# EAGLE design iv_diff_v2 (EAGLE 5.12)
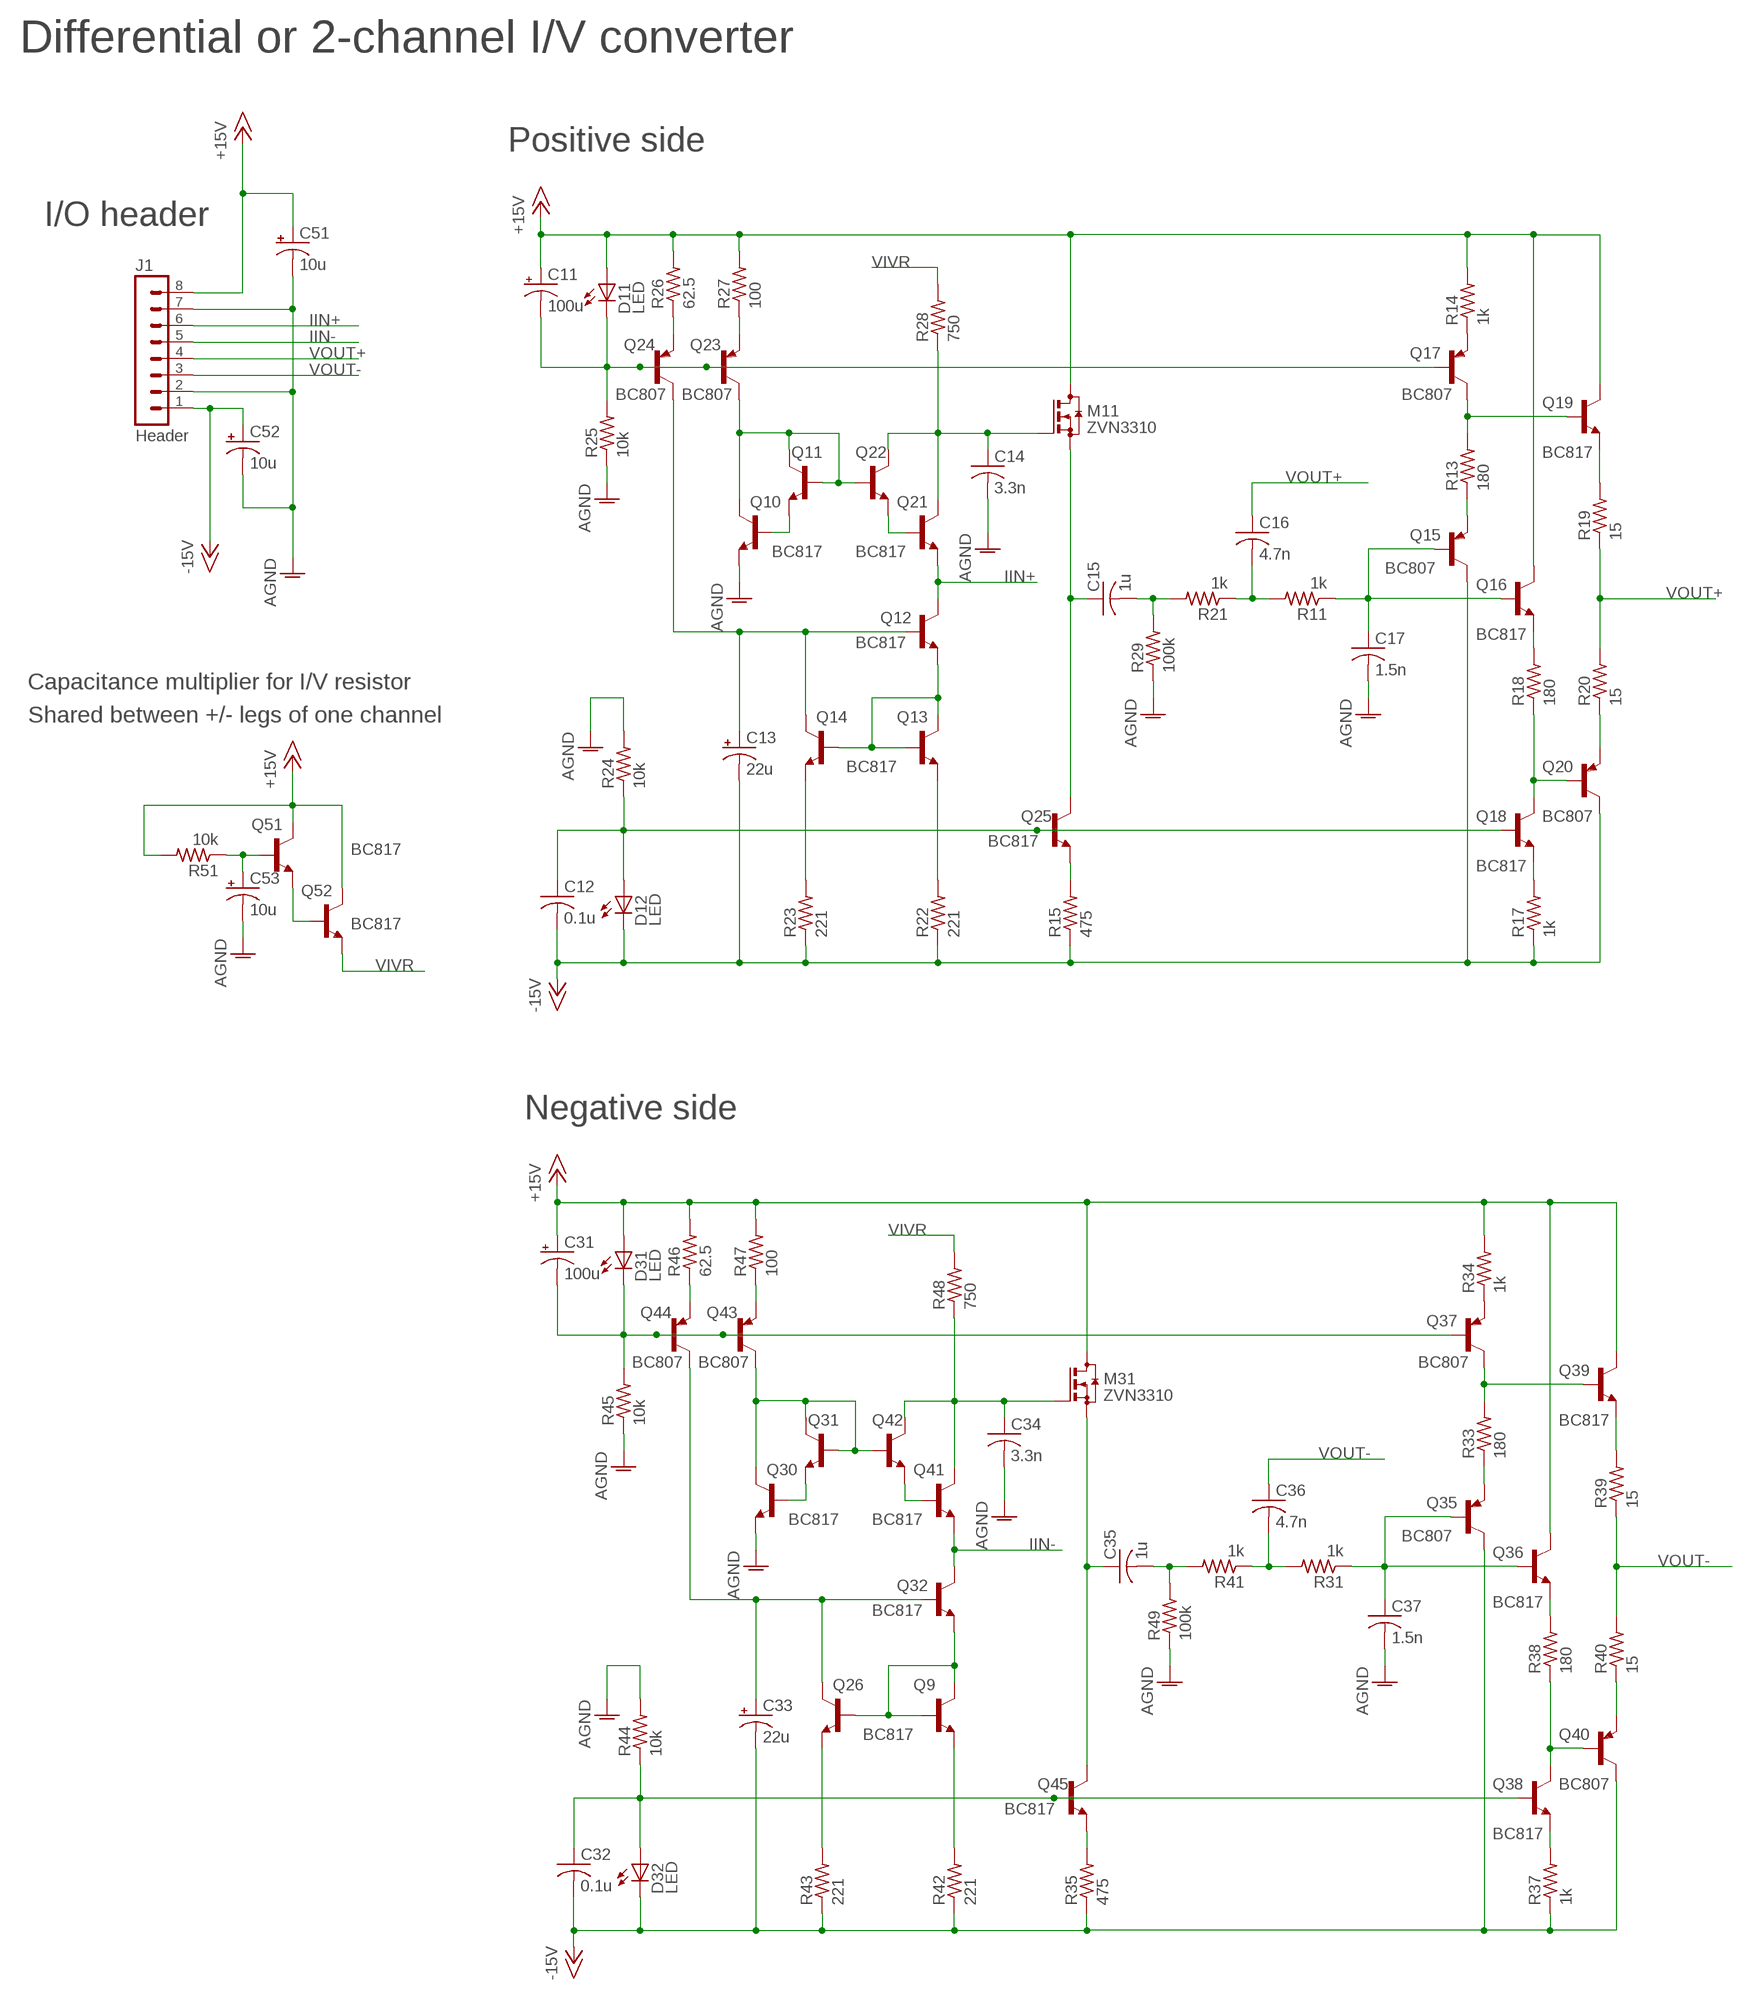
[diagram p0: schematic, sheet 1]

## Parts
C11  100u  CPOL-USC/6032-28R  [C/6032-28R]
C12  0.1u  C-USC1206  [C1206]
C13  22u  CPOL-USC/6032-28R  [C/6032-28R]
C14  3.3n  C-USC1206  [C1206]
C15  1u  C-US050-050X075  [C050-050X075]
C16  4.7n  C-USC1206  [C1206]
C17  1.5n  C-USC1206  [C1206]
C31  100u  CPOL-USC/6032-28R  [C/6032-28R]
C32  0.1u  C-USC1206  [C1206]
C33  22u  CPOL-USC/6032-28R  [C/6032-28R]
C34  3.3n  C-USC1206  [C1206]
C35  1u  C-US050-050X075  [C050-050X075]
C36  4.7n  C-USC1206  [C1206]
C37  1.5n  C-USC1206  [C1206]
C51  10u  CPOL-USC/6032-28R  [C/6032-28R]
C52  10u  CPOL-USC/6032-28R  [C/6032-28R]
C53  10u  CPOL-USC/6032-28R  [C/6032-28R]
D11  LED  LEDCHIPLED_1206  [CHIPLED_1206]
D12  LED  LEDCHIPLED_1206  [CHIPLED_1206]
D31  LED  LEDCHIPLED_1206  [CHIPLED_1206]
D32  LED  LEDCHIPLED_1206  [CHIPLED_1206]
J1  Header  MA08-1  [MA08-1]
M11  ZVN3310  BSS123  [SOT23]
M31  ZVN3310  BSS123  [SOT23]
Q9  BC817  BC817-40SMD  [SOT23-BEC]
Q10  BC817  BC817-40SMD  [SOT23-BEC]
Q11  BC817  BC817-40SMD  [SOT23-BEC]
Q12  BC817  BC817-40SMD  [SOT23-BEC]
Q13  BC817  BC817-40SMD  [SOT23-BEC]
Q14  BC817  BC817-40SMD  [SOT23-BEC]
Q15  BC807  BC807-40SMD  [SOT23-BEC]
Q16  BC817  BC817-40SMD  [SOT23-BEC]
Q17  BC807  BC807-40SMD  [SOT23-BEC]
Q18  BC817  BC817-40SMD  [SOT23-BEC]
Q19  BC817  BC817-40SMD  [SOT23-BEC]
Q20  BC807  BC807-40SMD  [SOT23-BEC]
Q21  BC817  BC817-40SMD  [SOT23-BEC]
Q22  BC817  BC817-40SMD  [SOT23-BEC]
Q23  BC807  BC807-40SMD  [SOT23-BEC]
Q24  BC807  BC807-40SMD  [SOT23-BEC]
Q25  BC817  BC817-40SMD  [SOT23-BEC]
Q26  BC817  BC817-40SMD  [SOT23-BEC]
Q30  BC817  BC817-40SMD  [SOT23-BEC]
Q31  BC817  BC817-40SMD  [SOT23-BEC]
Q32  BC817  BC817-40SMD  [SOT23-BEC]
Q35  BC807  BC807-40SMD  [SOT23-BEC]
Q36  BC817  BC817-40SMD  [SOT23-BEC]
Q37  BC807  BC807-40SMD  [SOT23-BEC]
Q38  BC817  BC817-40SMD  [SOT23-BEC]
Q39  BC817  BC817-40SMD  [SOT23-BEC]
Q40  BC807  BC807-40SMD  [SOT23-BEC]
Q41  BC817  BC817-40SMD  [SOT23-BEC]
Q42  BC817  BC817-40SMD  [SOT23-BEC]
Q43  BC807  BC807-40SMD  [SOT23-BEC]
Q44  BC807  BC807-40SMD  [SOT23-BEC]
Q45  BC817  BC817-40SMD  [SOT23-BEC]
Q51  BC817  BC817-40SMD  [SOT23-BEC]
Q52  BC817  BC817-40SMD  [SOT23-BEC]
R11  1k  R-US_R1206  [R1206]
R13  180  R-US_R1206  [R1206]
R14  1k  R-US_R1206  [R1206]
R15  475  R-US_R1206  [R1206]
R17  1k  R-US_R1206  [R1206]
R18  180  R-US_R1206  [R1206]
R19  15  R-US_R1206  [R1206]
R20  15  R-US_R1206  [R1206]
R21  1k  R-US_R1206  [R1206]
R22  221  R-US_R1206  [R1206]
R23  221  R-US_R1206  [R1206]
R24  10k  R-US_R1206  [R1206]
R25  10k  R-US_R1206  [R1206]
R26  62.5  R-US_R1206  [R1206]
R27  100  R-US_R1206  [R1206]
R28  750  R-US_R1206  [R1206]
R29  100k  R-US_R1206  [R1206]
R31  1k  R-US_R1206  [R1206]
R33  180  R-US_R1206  [R1206]
R34  1k  R-US_R1206  [R1206]
R35  475  R-US_R1206  [R1206]
R37  1k  R-US_R1206  [R1206]
R38  180  R-US_R1206  [R1206]
R39  15  R-US_R1206  [R1206]
R40  15  R-US_R1206  [R1206]
R41  1k  R-US_R1206  [R1206]
R42  221  R-US_R1206  [R1206]
R43  221  R-US_R1206  [R1206]
R44  10k  R-US_R1206  [R1206]
R45  10k  R-US_R1206  [R1206]
R46  62.5  R-US_R1206  [R1206]
R47  100  R-US_R1206  [R1206]
R48  750  R-US_R1206  [R1206]
R49  100k  R-US_R1206  [R1206]
R51  10k  R-US_R1206  [R1206]

## Nets
+15V: C11.+ C31.+ C51.+ D11.A D31.A J1.8 M11.3(D) M31.3(D) Q16.C Q19.C Q36.C Q39.C Q51.C Q52.C R14.2 R26.2 R27.2 R34.2 R46.2 R47.2 R51.2
-15V: C12.2 C13.- C32.2 C33.- C52.+ D12.C D32.C J1.1 Q15.C Q20.C Q35.C Q40.C R15.1 R17.1 R22.1 R23.1 R35.1 R37.1 R42.1 R43.1
AGND: C14.2 C17.2 C34.2 C37.2 C51.- C52.- C53.- J1.2 J1.7 Q10.E Q30.E R24.2 R25.1 R29.1 R44.2 R45.1 R49.1
IIN+: J1.6 Q12.C Q21.E
IIN-: J1.5 Q32.C Q41.E
N$1: Q10.C Q11.B Q11.C Q22.B Q23.C
N$2: C12.1 D12.A Q18.B Q25.B R24.1
N$3: C15.2 R21.2 R29.2
N$4: C15.1 M11.2(S) Q25.C
N$5: C11.- D11.C Q17.B Q23.B Q24.B R25.2
N$6: C32.1 D32.A Q38.B Q45.B R44.1
N$7: C53.+ Q51.B R51.1
N$8: Q51.E Q52.B
N$9: Q25.E R15.2
N$10: Q14.E R23.2
N$11: C14.1 M11.1(G) Q21.C Q22.C R28.1
N$12: Q13.E R22.2
N$13: C31.- D31.C Q37.B Q43.B Q44.B R45.2
N$14: C16.2 R11.2 R21.1
N$15: Q10.B Q11.E
N$16: Q21.B Q22.E
N$17: Q12.E Q13.B Q13.C Q14.B
N$18: C17.1 Q15.B Q16.B R11.1
N$19: C13.+ Q12.B Q14.C Q24.C
N$20: Q17.E R14.1
N$21: Q24.E R26.1
N$22: Q23.E R27.1
N$23: Q17.C Q19.B R13.2
N$24: Q15.E R13.1
N$25: Q18.E R17.2
N$26: Q18.C Q20.B R18.1
N$27: Q16.E R18.2
N$28: Q45.E R35.2
N$29: C35.1 M31.2(S) Q45.C
N$30: Q19.E R19.2
N$31: Q30.C Q31.B Q31.C Q42.B Q43.C
N$32: Q20.E R20.1
N$33: C34.1 M31.1(G) Q41.C Q42.C R48.1
N$34: Q30.B Q31.E
N$35: Q41.B Q42.E
N$36: Q26.E R43.2
N$37: Q9.E R42.2
N$38: Q9.B Q9.C Q26.B Q32.E
N$39: C33.+ Q26.C Q32.B Q44.C
N$40: Q44.E R46.1
N$41: Q43.E R47.1
N$42: C35.2 R41.2 R49.2
N$43: C36.2 R31.2 R41.1
N$44: C37.1 Q35.B Q36.B R31.1
N$45: Q37.E R34.1
N$46: Q37.C Q39.B R33.2
N$47: Q35.E R33.1
N$48: Q38.E R37.2
N$49: Q38.C Q40.B R38.1
N$50: Q36.E R38.2
N$51: Q39.E R39.2
N$52: Q40.E R40.1
VIVR: Q52.E R28.2 R48.2
VOUT+: C16.1 J1.4 R19.1 R20.2
VOUT-: C36.1 J1.3 R39.1 R40.2

## Notes on the sheet
- Differential or 2-channel I/V converter
- Positive side
- I/O header
- Capacitance multiplier for I/V resistor
- Shared between +/- legs of one channel
- Negative side

## Library data of the parts
C11 C13 C31 C33 C51-C53 = rcl:CPOL-US: POLARIZED CAPACITOR, American symbol
C12 C14-C17 C32 C34-C37 = rcl:C-US: CAPACITOR, American symbol
D11 D12 D31 D32 = led:LED: LED OSRAM: - CHIPLED LG R971, LG N971, LY N971, LG Q971, LY Q971, LO R971, LY R971 LH N974, LH R974 LS Q976, LO Q976, LY Q976 LO Q996 - Hyper CHIPLED LW Q18S LB Q993, LB Q99A, LB R99A - SideLED LS A670, LO A670, LY A670, LG A670, LP A670 LB A673, LV A673, LT A673, LW A673 LH A674 LY A675 LS A676, LA A676, LO A676, LY A676, LW A676 LS A679, LY A679, LG A679 - Hyper Micro SIDELED® LS Y876, LA Y876, LO Y876, LY Y876 LT Y87S - SmartLED LW L88C, LW L88S LB L89C, LB L89S, LG L890 LS L89K, LO L89K, LY L89K LS L896, LA L896, LO L896, LY L896 - TOPLED LS T670, LO T670, LY T670, LG T670, LP T670 LSG T670, LSP T670, LSY T670, LOP T670, LYG T670 LG T671, LOG T671, LSG T671 LB T673, LV T673, LT T673, LW T673 LH T674 LS T676, LA T676, LO T676, LY T676, LB T676, LH T676, LSB T676, LW T676 LB T67C, LV T67C, LT T67C, LS T67K, LO T67K, LY T67K, LW E67C LS E67B, LA E67B, LO E67B, LY E67B, LB E67C, LV E67C, LT E67C LW T67C LS T679, LY T679, LG T679 LS T770, LO T770, LY T770, LG T770, LP T770 LB T773, LV T773, LT T773, LW T773 LH T774 LS E675, LA E675, LY E675, LS T675 LS T776, LA T776, LO T776, LY T776, LB T776 LHGB T686 LT T68C, LB T68C - Hyper Mini TOPLED® LB M676 - Mini TOPLED Santana® LG M470 LS M47K, LO M47K, LY M47K Source: http://www.osram.convergy.de LUXEON: - LUMILED® LXK2-PW12-R00, LXK2-PW12-S00, LXK2-PW14-U00, LXK2-PW14-V00 LXK2-PM12-R00, LXK2-PM12-S00, LXK2-PM14-U00 LXK2-PE12-Q00, LXK2-PE12-R00, LXK2-PE12-S00, LXK2-PE14-T00, LXK2-PE14-U00 LXK2-PB12-K00, LXK2-PB12-L00, LXK2-PB12-M00, LXK2-PB14-N00, LXK2-PB14-P00, LXK2-PB14-Q00 LXK2-PR12-L00, LXK2-PR12-M00, LXK2-PR14-Q00, LXK2-PR14-R00 LXK2-PD12-Q00, LXK2-PD12-R00, LXK2-PD12-S00 LXK2-PH12-R00, LXK2-PH12-S00 LXK2-PL12-P00, LXK2-PL12-Q00, LXK2-PL12-R00 Source: www.luxeon.com KINGBRIGHT: KA-3528ASYC Source: www.kingbright.com
J1 = cdp:MA08-1: PIN HEADER
M11 M31 = transistor-small-signal:BSS123: N-CHANNEL MOS FET
Q9-Q14 Q16 Q18 Q19 Q21 Q22 Q25 Q26 Q30-Q32 Q36 Q38 Q39 Q41 Q42 Q45 Q51 Q52 = transistor-npn:BC817*: NPN Transistor
Q15 Q17 Q20 Q23 Q24 Q35 Q37 Q40 Q43 Q44 = transistor-pnp:BC807*: PNP Transistror
R11 R13-R15 R17-R29 R31 R33-R35 R37-R49 R51 = rcl:R-US_: RESISTOR, American symbol

## Board
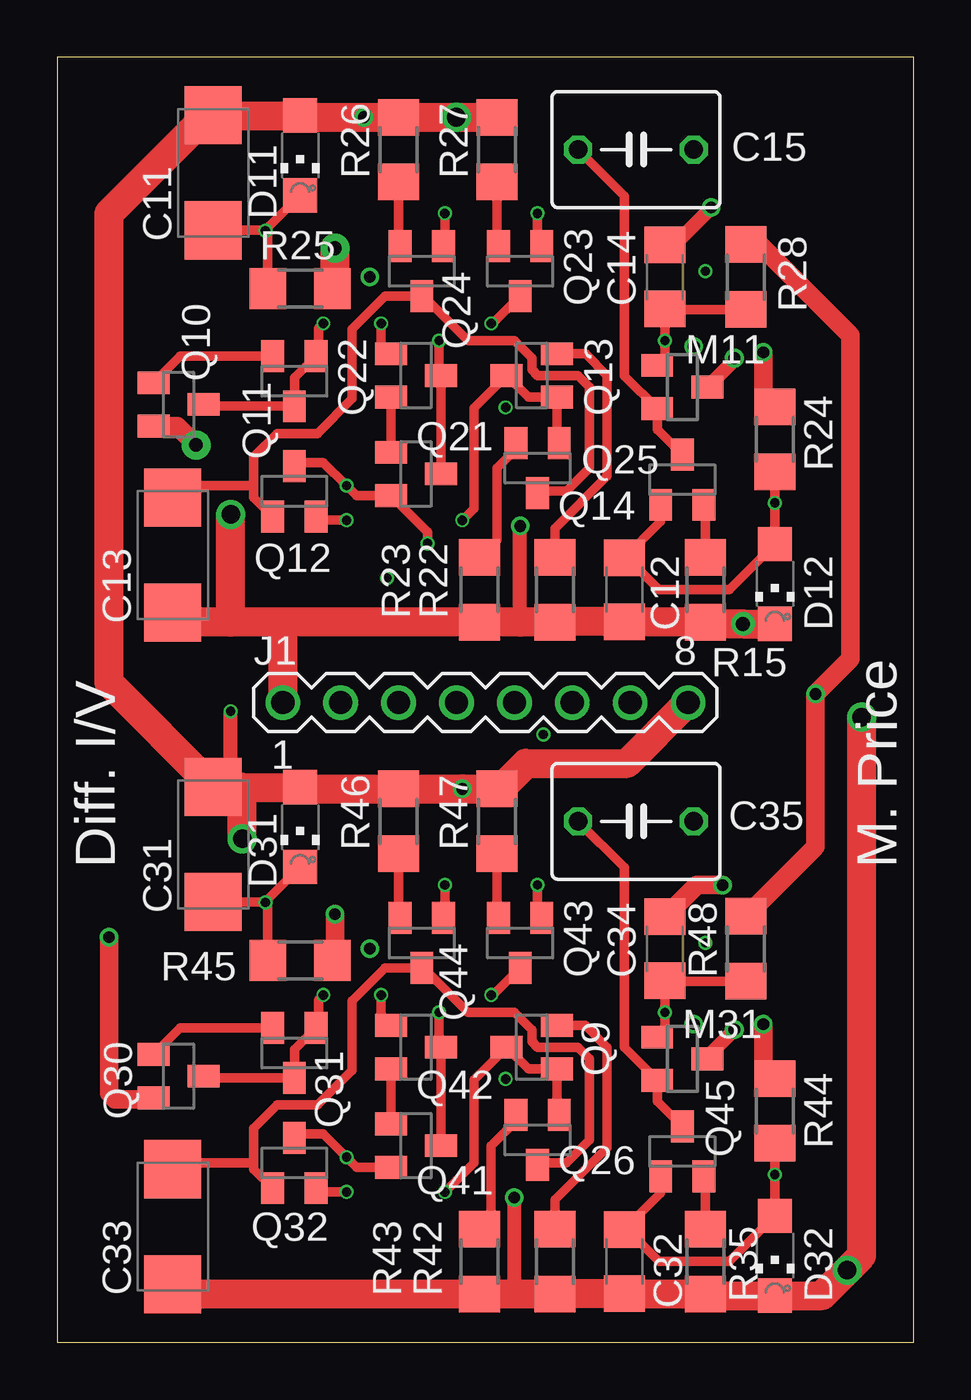
[diagram p1: board, top side]
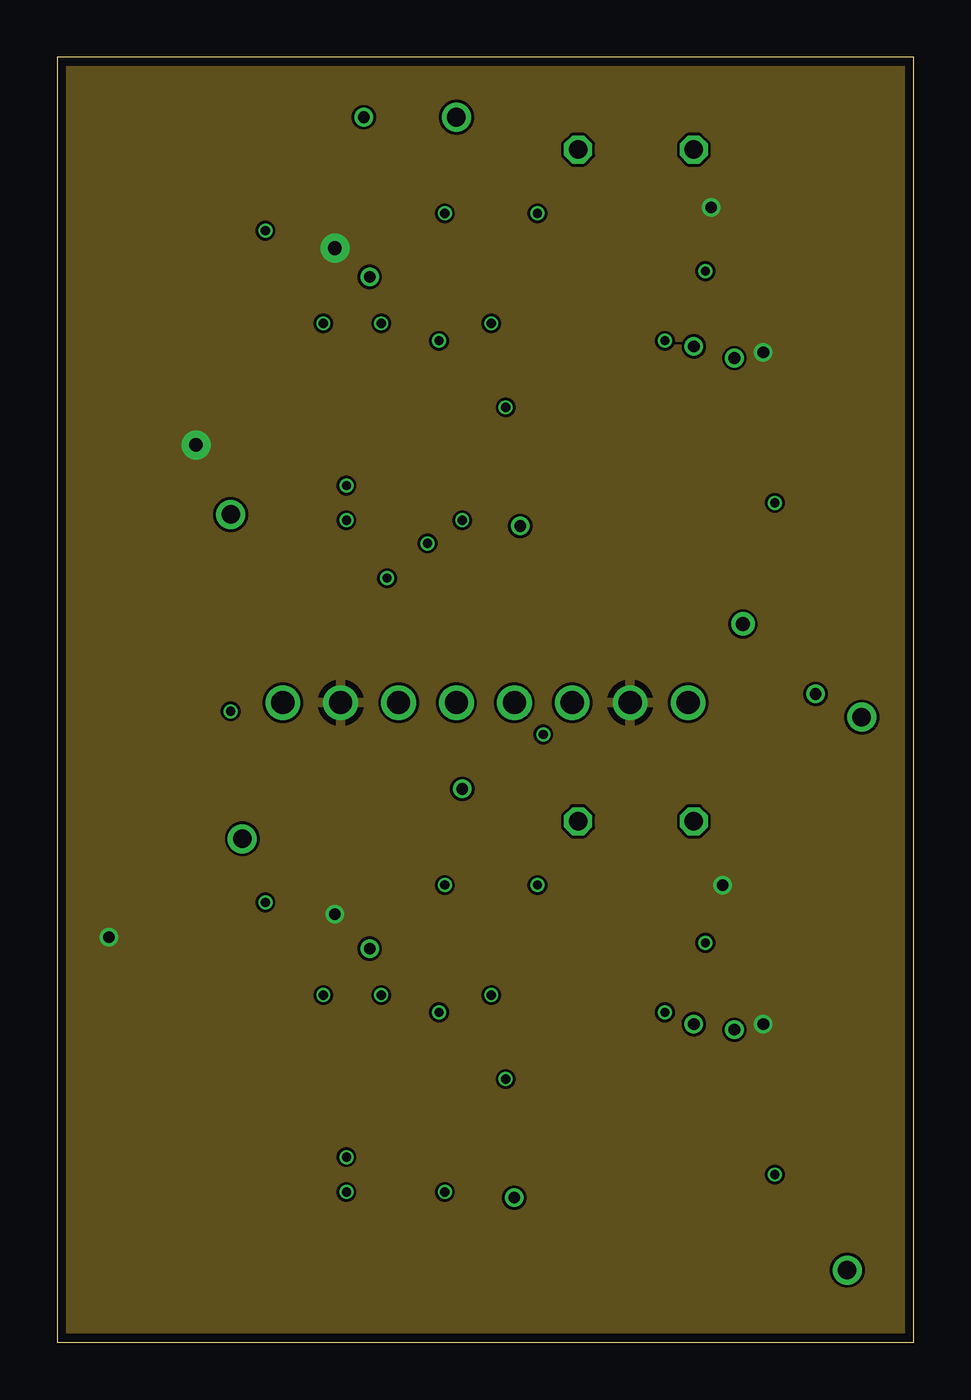
[diagram p2: board, inner layer Route2]
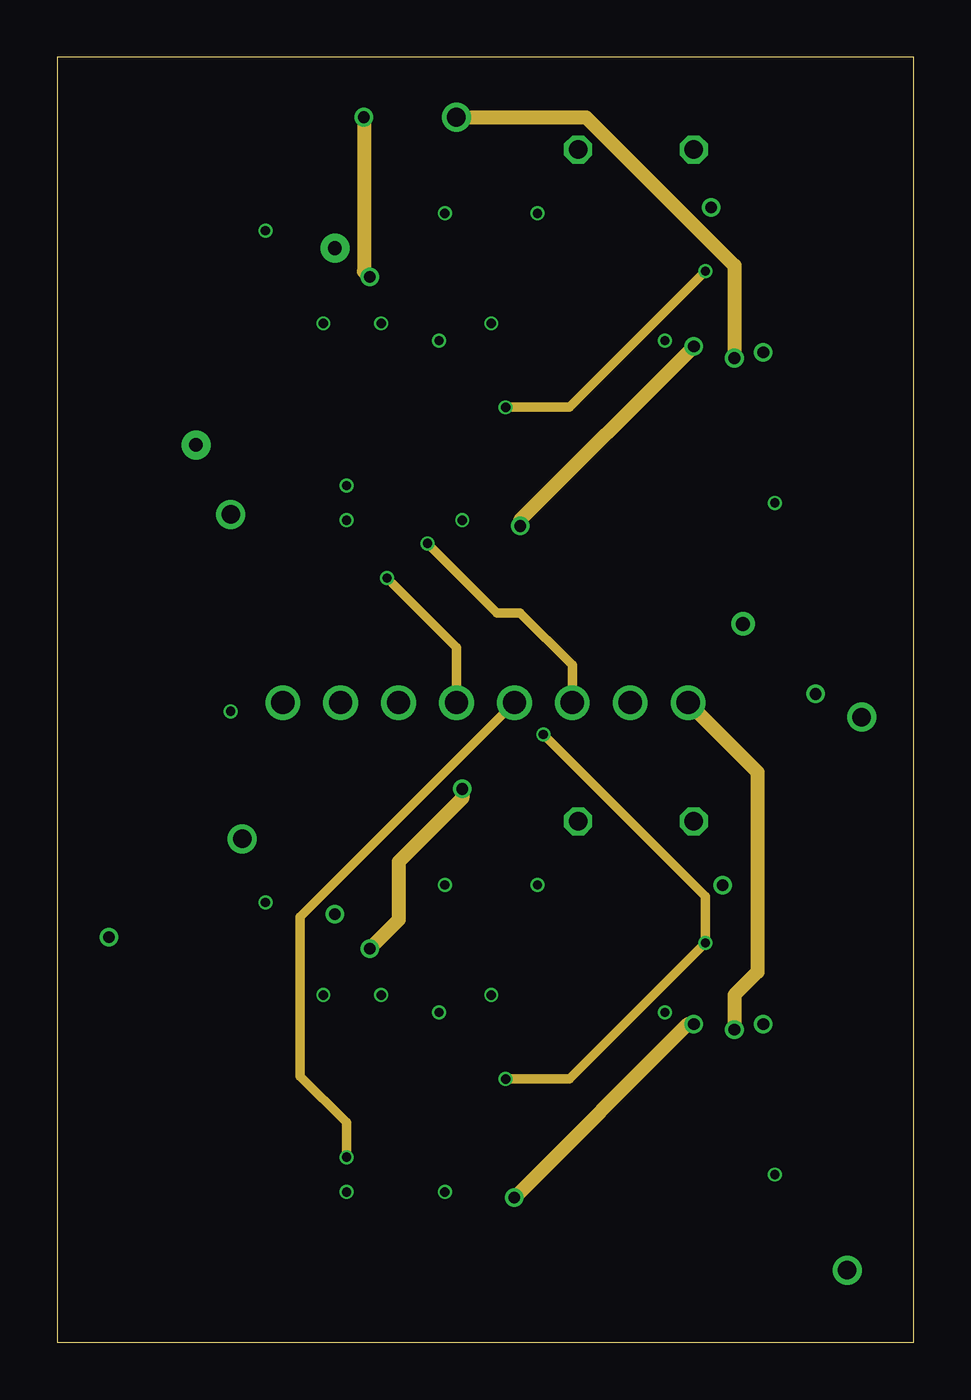
[diagram p3: board, inner layer Route15]
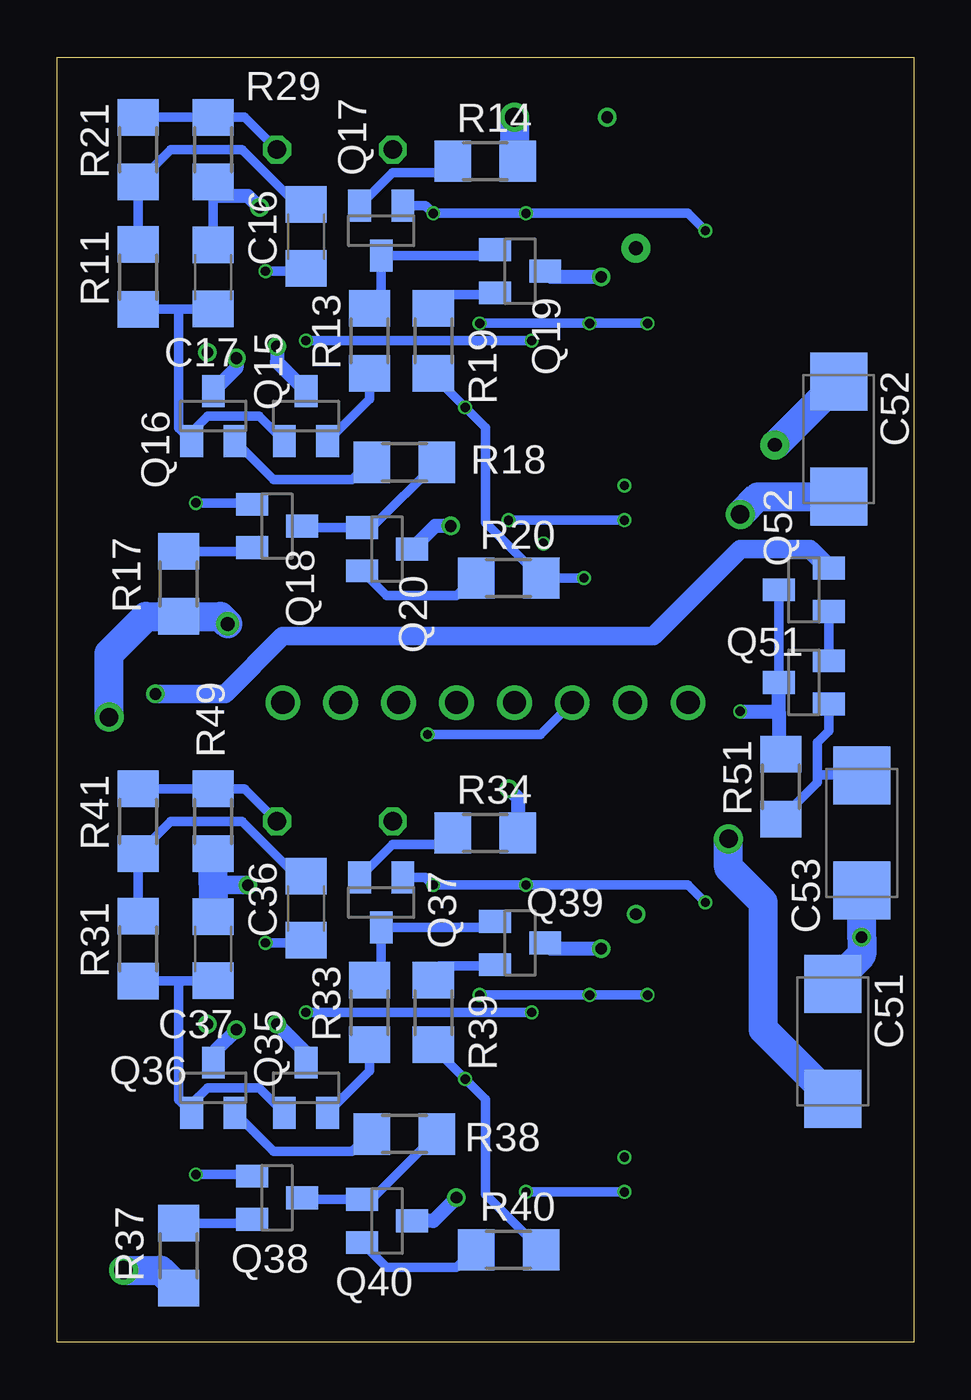
[diagram p4: board, bottom side, seen from below]

Size 37.59 x 56.39 mm. Coordinates in mm from the lower left corner, seen from the top.
Outline: 0,0 37.59,0 37.59,56.39 0,56.39 0,0
Copper layers (1*2*15*16): Top 0.0356mm / dielectric 0.1702mm / Route2 0.0178mm / dielectric 1.1938mm / Route15 0.0178mm / dielectric 0.1702mm / Bottom 0.0356mm
Design rules "OSHPark-4layer *": minimum track width 5mil, minimum drill 10mil, track to track 5mil, track to pad 5mil, pad to pad 5mil, via to via 5mil, smd to smd 5mil, copper to edge 15mil, drill to drill 6mil, minimum pad ring 4mil, minimum via ring 4mil, stop-mask expansion 2.5mil, vias tented up to drill 100mil, thermal gap 10mil

### Footprints (pad centres in the part's own frame; a part is rotated, then mirrored left to right if it is on the bottom)
C/6032-28R = smd 2.55 x 2.5: + 2.525,0; - -2.525,0
C1206 = smd 1.6 x 1.8: 1 -1.4,0; 2 1.4,0
C050-050X075 = drill 0.813 octagon: 1 -2.54,0; 2 2.54,0
CHIPLED_1206 = smd 1.5 x 1.5: A 0,-1.75; C 0,1.75
MA08-1 = drill 1.016 pad 1.422 round: 1 -8.89,0; 2 -6.35,0; 3 -3.81,0; 4 -1.27,0; 5 1.27,0; 6 3.81,0; 7 6.35,0; 8 8.89,0
SOT23 = smd 1 x 1.4: 1 -0.95,-1.1; 2 0.95,-1.1; 3 0,1.1
SOT23-BEC = smd 1 x 1.4: B -0.95,-1.1; C 0,1.1; E 0.95,-1.1
R1206 = smd 1.6 x 1.803: 1 -1.422,0; 2 1.422,0

### Placement (x,y rotation side)
C11  6.86,51.31 90 top
C12  24.89,33.02 270 top
C13  5.08,34.54 90 top
C14  26.67,46.74 90 top
C15  25.4,52.32 0 top
C16  26.67,48.51 90 bottom
C17  30.73,46.74 90 bottom
C31  6.86,21.84 90 top
C32  24.89,3.56 270 top
C33  5.08,5.08 90 top
C34  26.67,17.27 90 top
C35  25.4,22.86 0 top
C36  26.67,19.05 90 bottom
C37  30.73,17.27 90 bottom
C51  3.56,13.21 270 bottom
C52  3.3,39.62 270 bottom
C53  2.29,22.35 90 bottom
D11  10.67,52.07 180 top
D12  31.5,33.27 180 top
D31  10.67,22.61 180 top
D32  31.5,3.81 180 top
J1  18.8,28.07 0 top
M11  27.43,41.91 270 top
M31  27.43,12.45 270 top
Q9  20.83,12.95 90 top
Q10  5.33,41.15 270 top
Q11  10.41,42.16 180 top
Q12  10.41,37.34 0 top
Q13  20.83,42.42 90 top
Q14  21.08,38.35 180 top
Q15  26.67,40.64 0 bottom
Q16  30.73,40.64 0 bottom
Q17  23.37,48.77 180 bottom
Q18  27.94,35.81 270 bottom
Q19  17.27,46.99 270 bottom
Q20  23.11,34.8 270 bottom
Q21  15.75,38.1 270 top
Q22  15.75,42.42 270 top
Q23  20.32,46.99 180 top
Q24  16,46.99 180 top
Q25  27.43,37.85 0 top
Q26  21.08,8.89 180 top
Q30  5.33,11.68 270 top
Q31  10.41,12.7 180 top
Q32  10.41,7.87 0 top
Q35  26.67,11.18 0 bottom
Q36  30.73,11.18 0 bottom
Q37  23.37,19.3 180 bottom
Q38  27.94,6.35 270 bottom
Q39  17.27,17.53 270 bottom
Q40  23.11,5.33 270 bottom
Q41  15.75,8.64 270 top
Q42  15.75,12.95 270 top
Q43  20.32,17.53 180 top
Q44  16,17.53 180 top
Q45  27.43,8.38 0 top
Q51  4.83,28.96 90 bottom
Q52  4.83,33.02 90 bottom
R11  34.04,46.74 90 bottom
R13  23.88,43.94 90 bottom
R14  18.8,51.82 0 bottom
R15  28.45,33.02 90 top
R17  32.26,33.27 90 bottom
R18  22.35,38.61 180 bottom
R19  21.08,43.94 90 bottom
R20  17.78,33.53 0 bottom
R21  34.04,52.32 90 bottom
R22  21.84,33.02 90 top
R23  18.54,33.02 90 top
R24  31.5,39.62 90 top
R25  10.67,46.23 180 top
R26  14.99,52.32 90 top
R27  19.3,52.32 90 top
R28  30.23,46.74 90 top
R29  30.73,52.32 90 bottom
R31  34.04,17.27 90 bottom
R33  23.88,14.48 90 bottom
R34  18.8,22.35 0 bottom
R35  28.45,3.56 90 top
R37  32.26,3.81 90 bottom
R38  22.35,9.14 180 bottom
R39  21.08,14.48 90 bottom
R40  17.78,4.06 0 bottom
R41  34.04,22.86 90 bottom
R42  21.84,3.56 90 top
R43  18.54,3.56 90 top
R44  31.5,10.16 90 top
R45  10.67,16.76 180 top
R46  14.99,22.86 90 top
R47  19.3,22.86 90 top
R48  30.23,17.27 90 top
R49  30.73,22.86 90 bottom
R51  5.84,24.38 90 bottom

### Tracks (layer width: path | path; a pad name or v marks a point on that pad's centre or on a via)
+15V  (via drill 0.41 pad 0.61, 0.51 pad 0.81, 0.81 pad 1.27)
  Top 0.61: 6.87,24.36 7.62,25.11 v7.62,27.69 | M31.3 28.7,12.62 28.7,12.7 v29.72,13.72 | M11.3 29.72,43.1 v29.72,43.18
  Top 1.27: 6.87,53.82 C11.+ | 6.87,53.82 D11.A 10.74,53.75 v13.46,53.75 R26.2 v17.53,53.75 R27.2 | 8.13,24.36 6.87,24.36 C31.+ 2.29,28.94 2.29,49.53 6.58,53.82 6.87,53.82 | 8.13,24.36 D31.A 10.74,24.28 R46.2 v17.78,24.28 R47.2 19.46,24.28 20.57,25.4 25.02,25.4 J1.8 | v8.13,22.1 8.13,24.36
  Route15 0.61: J1.8 30.73,25.02 30.73,16.26 29.72,15.24 v29.72,13.72 | v13.72,17.27 14.99,18.54 14.99,21.08 17.78,23.88 v17.78,24.28 | v13.72,46.74 13.46,46.99 v13.46,53.75 | v29.72,43.18 29.72,47.24 23.22,53.75 v17.53,53.75
  Bottom 0.406: Q51.C Q52.C | 5.93,25.89 R51.2
  Bottom 0.61: 5.93,27.69 5.93,25.89 | 5.93,27.69 Q51.C | v7.62,27.69 5.93,27.69 | Q36.C 30.65,12.28 30.65,12.78 v29.72,13.72 | Q39.C 15.92,17.27 v13.72,17.27 | v17.78,24.28 17.37,23.88 R34.2 | Q19.C 15.92,46.74 v13.72,46.74 | Q16.C 29.72,42.76 v29.72,43.18
  Bottom 1.27: R14.2 17.53,51.97 v17.53,53.75 | C51.+ 6.6,13.73 6.6,19.3 8.13,20.83 v8.13,22.1
-15V  (via drill 0.51 pad 0.81, 0.61 pad 1.02, 0.81 pad 1.27)
  Top 0.406: 19.81,2.13 20.07,2.39
  Top 0.61: 20.32,31.6 v20.32,35.81 | 20.07,2.39 v20.07,6.35
  Top 1.27: C13.- 5.5,31.6 7.62,31.6 | 9.91,31.6 7.62,31.6 | 9.91,31.6 R23.1 20.32,31.6 R22.1 21.87,31.62 C12.2 24.91,31.6 R15.1 28.52,31.52 v30.1,31.52 D12.C | C33.- 5.5,2.13 R43.1 19.81,2.13 R42.1 21.87,2.16 C32.2 24.91,2.13 R35.1 28.52,2.06 D32.C 33.56,2.06 v34.67,3.17 35.31,3.81 v35.31,27.43 | 9.91,31.6 J1.1 | 7.62,31.6 v7.62,36.32
  Route15 0.61: v27.94,43.69 20.32,36.07 v20.32,35.81 | v27.94,13.97 27.69,13.97 v20.07,6.35
  Bottom 0.61: Q20.C 21,35.81 v20.32,35.81 | Q15.C 27.94,43.01 v27.94,43.69 | Q40.C 21.08,5.33 v20.07,6.35 | Q35.C 26.67,12.7 v27.94,13.97
  Bottom 1.27: v7.62,36.32 6.84,37.1 C52.+ | v35.31,27.43 35.31,30.23 33.68,31.85 R17.1 30.43,31.85 v30.1,31.52 | R37.1 33.05,3.17 v34.67,3.17
AGND  (via drill 0.51 pad 0.81, 0.6 pad 1.27)
  Top 0.61: v28.7,49.78 27.05,48.14 C14.2
  Top 0.813: R24.2 30.99,41.55 v30.99,43.43 | R44.2 30.99,12.09 v30.99,13.97 | C34.2 28.06,20.07 v29.21,20.07 | R45.1 12.19,16.87 v12.19,18.8 | Q30.E 4.17,10.67 2.54,10.67 2.29,10.92 v2.29,17.78 | v6.1,39.37 5.27,40.2 Q10.E
  Top 1.27: R25.1 12.19,46.23 v12.19,48.01
  Bottom 0.406: C17.2 30.73,50.29 R29.1
  Bottom 0.61: v28.7,49.78 29.21,50.29 30.73,50.29
  Bottom 0.813: v29.21,20.07 30.73,20.07
  Bottom 1.27: C37.2 30.73,20.07 R49.1 | C51.- 2.29,17 v2.29,17.78 C53.- | C52.- 6.08,39.37 v6.1,39.37
  pour Route2: 0,56.39 37.59,56.39 37.59,-0.25 0,-0.25
IIN+  (via drill 0.41 pad 0.61)
  Top 0.406: Q12.C 10.58,38.61 11.68,38.61 v12.7,37.59 13.14,37.15 Q21.E 16.26,35.54 v16.26,35.05
  Route15 0.406: v16.26,35.05 19.3,32 20.32,32 22.61,29.72 J1.6
IIN-  (via drill 0.41 pad 0.61)
  Top 0.406: Q32.C 10.58,9.14 11.68,9.14 v12.7,8.13 13.14,7.69 Q41.E
  Route15 0.406: J1.5 10.67,18.67 10.67,11.68 12.7,9.65 v12.7,8.13
N$1  (via drill 0.41 pad 0.61)
  Top 0.406: Q10.C 6.52,41.06 Q11.C 10.41,42.31 Q11.B 11.47,43.37 11.47,44.49 v11.68,44.7 | v14.22,44.7 14.22,43.79 Q22.B | Q23.C 19.13,44.7 v19.05,44.7
  Bottom 0.406: v11.68,44.7 v14.22,44.7 v19.05,44.7
N$2  (via drill 0.41 pad 0.61)
  Top 0.406: R24.1 v31.5,36.83 D12.A 29.49,33.02 26.42,33.02 25.02,34.42 C12.1 26.48,36.01 Q25.B
  Bottom 0.406: Q18.B 29.11,36.83 v31.5,36.83
N$3
  Bottom 0.406: C15.2 29.36,53.75 R29.2 R21.2
N$4
  Top 0.406: Q25.C 26.33,40.05 M11.2 24.89,42.4 24.89,50.29 C15.1
N$5  (via drill 0.41 pad 0.61)
  Top 0.406: Q24.B 17.02,48.09 v17.02,49.53 | 9.13,48.78 C11.- | 9.13,48.78 D11.C | R25.2 9.25,48.67 v9.15,48.77 | v9.15,48.77 9.13,48.78 | v9.15,48.77 v9.14,48.77 | v21.08,49.53 21.08,48.28 Q23.B
  Bottom 0.406: v9.14,48.77 9.91,49.53 v17.02,49.53 v21.08,49.53 21.42,49.87 Q17.B
N$6  (via drill 0.41 pad 0.61)
  Top 0.406: R44.1 v31.5,7.37 D32.A 29.49,3.56 26.42,3.56 25.02,4.96 C32.1 26.48,6.55 Q45.B
  Bottom 0.406: Q38.B 29.11,7.37 v31.5,7.37
N$7
  Bottom 0.406: R51.1 4.24,24.56 4.24,24.89 | Q51.B 3.73,26.82 4.24,26.31 4.24,24.89 | C53.+ 2.3,24.89 4.24,24.89
N$8
  Bottom 0.406: Q51.E Q52.B
N$9
  Top 0.406: Q25.E 28.45,36.68 R15.2
N$10
  Top 0.406: R23.2 19.3,35.2 19.3,38.35 20.13,39.18 Q14.E
N$11  (via drill 0.41 pad 0.61)
  Top 0.406: Q21.C Q22.C 16.76,42.5 v16.76,43.94 | M11.1 26.67,43.2 v26.67,43.94 C14.1 26.69,45.31 R28.1
  Bottom 0.406: v16.76,43.94 v26.67,43.94
N$12
  Top 0.406: 22.12,43.18 Q13.E 23.18,43.37 24.13,42.42 24.13,38 21.84,35.71 R22.2
N$13  (via drill 0.41 pad 0.61)
  Top 0.406: Q44.B 17.02,18.63 v17.02,20.07 | 9.13,19.32 C31.- | 9.13,19.32 D31.C | R45.2 9.25,19.2 v9.15,19.3 | v9.15,19.3 9.13,19.32 | v9.15,19.3 v9.14,19.3 | v21.08,20.07 21.08,18.81 Q43.B
  Bottom 0.406: v9.14,19.3 9.91,20.07 v17.02,20.07 v21.08,20.07 21.42,20.4 Q37.B
N$14
  Bottom 0.406: R11.2 R21.1 32.61,52.32 29.46,52.32 27.05,49.91 C16.2
N$15
  Top 0.406: Q10.B 5.4,43.26 Q11.E
N$16
  Top 0.406: Q21.B Q22.E
N$17  (via drill 0.41 pad 0.61)
  Top 0.406: Q14.B 21.93,39.45 Q13.B 20.68,41.47 Q13.C 18.29,40.98 18.29,36.58 v17.78,36.07 | 11.36,36.64 Q12.E 11.53,36.07 v12.7,36.07
  Bottom 0.406: v12.7,36.07 v17.78,36.07
N$18
  Bottom 0.406: R11.1 34.01,45.34 32.26,45.34 | 32.26,45.34 C17.1 | Q15.B 28.72,40.64 30.99,40.64 31.68,39.94 Q16.B 32.26,40.11 32.26,45.34
N$19
  Top 0.406: Q12.B 8.64,37.07 8.64,37.59 | 8.64,37.59 8.64,38.86 9.65,39.88 11.43,39.88 12.95,41.4 12.95,44.45 14.39,45.89 Q24.C 16.09,45.89 18.03,43.94 20.07,43.94 20.83,43.18 20.83,42.67 21.08,42.42 22.86,42.42 23.37,41.91 23.37,38.35 22.35,37.34 21.17,37.34 Q14.C | C13.+ 5.6,37.59 8.64,37.59
N$20
  Bottom 0.406: Q17.E 22.88,51.31 20.32,51.31 20.22,51.41 R14.1
N$21
  Top 0.406: R26.1 14.99,48.16 Q24.E
N$22
  Top 0.406: R27.1 19.3,48.16 Q23.E
N$23
  Bottom 0.406: R13.2 23.37,45.87 Q17.C 18.64,47.67 Q19.B
N$24
  Bottom 0.406: Q15.E 23.88,41.38 R13.1
N$25
  Bottom 0.406: Q18.E 29.21,34.7 R17.2
N$26
  Bottom 0.406: Q18.C 26.77,35.75 Q20.B 23.79,35.75 R18.1
N$27
  Bottom 0.406: Q16.E 28.09,37.85 24.64,37.85 23.88,38.61 R18.2
N$28
  Top 0.406: Q45.E 28.45,7.22 R35.2
N$29
  Top 0.406: Q45.C 26.33,10.58 M31.2 24.89,12.94 24.89,20.83 C35.1
N$30
  Bottom 0.406: Q19.E 18.44,45.97 20.83,45.97 21.08,45.72 R19.2
N$31  (via drill 0.41 pad 0.61)
  Top 0.406: Q30.C 6.52,11.6 Q31.C 10.41,12.85 Q31.B 11.47,13.9 11.47,15.02 v11.68,15.24 | v14.22,15.24 14.22,14.33 Q42.B | Q43.C 19.13,15.24 v19.05,15.24
  Bottom 0.406: v11.68,15.24 v14.22,15.24 v19.05,15.24
N$32
  Bottom 0.406: Q20.E 23.13,32.77 20.07,32.77 19.3,33.53 R20.1
N$33  (via drill 0.41 pad 0.61)
  Top 0.406: Q41.C Q42.C 16.76,13.04 v16.76,14.48 | M31.1 26.67,13.73 v26.67,14.48 C34.1 26.69,15.85 R48.1
  Bottom 0.406: v16.76,14.48 v26.67,14.48
N$34
  Top 0.406: Q30.B 5.4,13.8 Q31.E
N$35
  Top 0.406: Q41.B Q42.E
N$36
  Top 0.406: Q26.E 20.13,9.72 19.05,8.64 19.05,5.49 R43.2
N$37
  Top 0.406: 22.12,13.72 Q9.E 23.18,13.9 24.13,12.95 24.13,8.53 21.84,6.25 R42.2
N$38  (via drill 0.41 pad 0.61)
  Top 0.406: Q26.B 21.93,9.99 Q9.B 20.68,12 Q9.C 18.29,11.51 18.29,7.87 v17.02,6.6 | 11.36,7.18 Q32.E 11.53,6.6 v12.7,6.6
  Bottom 0.406: v12.7,6.6 v17.02,6.6
N$39
  Top 0.406: Q32.B 8.64,7.6 8.64,7.87 | 8.64,7.87 8.64,9.4 9.65,10.41 11.43,10.41 12.95,11.94 12.95,14.99 14.39,16.43 Q44.C 16.09,16.43 18.03,14.48 20.07,14.48 20.83,13.72 20.83,13.21 21.08,12.95 22.86,12.95 23.37,12.45 23.37,8.89 22.35,7.87 21.17,7.87 Q26.C | C33.+ 5.35,7.87 8.64,7.87
N$40
  Top 0.406: R46.1 14.99,18.69 Q44.E
N$41
  Top 0.406: R47.1 19.3,18.69 Q43.E
N$42
  Bottom 0.406: C35.2 29.36,24.28 R49.2 R41.2
N$43
  Bottom 0.406: R31.2 R41.1 32.61,22.86 29.46,22.86 27.05,20.45 C36.2
N$44
  Bottom 0.406: R31.1 34.01,15.87 32.26,15.87 | 32.26,15.87 C37.1 | Q35.B 28.72,11.18 30.99,11.18 31.68,10.48 Q36.B 32.26,10.65 32.26,15.87
N$45
  Bottom 0.406: Q37.E 22.88,21.84 20.32,21.84 20.22,21.95 R34.1
N$46
  Bottom 0.406: R33.2 23.37,16.41 Q37.C 18.64,18.2 Q39.B
N$47
  Bottom 0.406: Q35.E 23.88,11.92 R33.1
N$48
  Bottom 0.406: Q38.E 29.21,5.23 R37.2
N$49
  Bottom 0.406: Q38.C 26.77,6.28 Q40.B 23.79,6.28 R38.1
N$50
  Bottom 0.406: Q36.E 28.09,8.38 24.64,8.38 23.88,9.14 R38.2
N$51
  Bottom 0.406: Q39.E 18.44,16.51 20.83,16.51 21.08,16.26 R39.2
N$52
  Bottom 0.406: Q40.E 23.13,3.3 20.07,3.3 19.3,4.06 R40.1
VIVR  (via drill 0.51 pad 0.81)
  Top 0.813: R28.2 30.84,48.16 34.8,44.2 34.8,29.97 v33.27,28.45 33.27,21.74 R48.2
  Bottom 0.813: Q52.E 4.55,34.8 7.62,34.8 11.43,30.99 27.69,30.99 30.23,28.45 v33.27,28.45
VOUT+  (via drill 0.41 pad 0.61)
  Route15 0.406: v28.45,46.99 22.48,41.02 v19.68,41.02 | v14.48,33.53 17.53,30.48 J1.4
  Bottom 0.406: R19.1 21.08,42.42 v19.68,41.02 18.8,40.13 18.8,35.97 R20.2 v14.48,33.53 | C16.1 26.79,46.99 v28.45,46.99
VOUT-  (via drill 0.41 pad 0.61)
  Route15 0.406: v19.68,11.56 22.48,11.56 v28.45,17.53 28.45,19.56 v21.34,26.67
  Bottom 0.406: R39.1 21.08,12.95 v19.68,11.56 18.8,10.67 18.8,6.5 R40.2 | C36.1 26.79,17.53 v28.45,17.53 | J1.3 16.38,26.67 v21.34,26.67

### Text on the board
tPlace: Diff. I/V | M. Price